# EAGLE schematic superbike-charger (EAGLE 9.6.1)
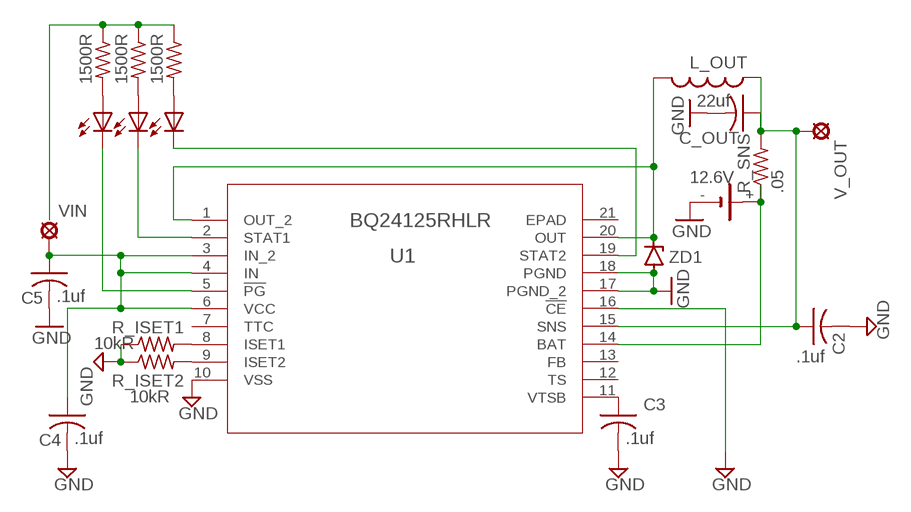
[diagram p0: schematic, sheet 1]

## Parts
12.6V  SL340P  [SL-340/P3.6V]
C2  .1uf  C-USC0805  [C0805]
C3  .1uf  C-USC0805  [C0805]
C4  .1uf  C-USC0805  [C0805]
C5  .1uf  C-USC0805  [C0805]
C_OUT  22uf  C-USC0805  [C0805]
L_OUT  L-USL3216C  [L3216C]
LED1  LED  [SMARTLED-TTW]
LED2  LED  [SMARTLED-TTW]
LED3  LED  [SMARTLED-TTW]
R_ISET1  10kR  R-US_R0805  [R0805]
R_ISET2  10kR  R-US_R0805  [R0805]
R_SNS  .05  R-US_R0402  [R0402]
RSYS1  1500R  R-US_R0805  [R0805]
RSYS2  1500R  R-US_R0805  [R0805]
RSYS3  1500R  R-US_R0805  [R0805]
U1  BQ24125RHLR  [RHL20_2P05X3P05]
V_OUT  LSP13  [LSP13]
VIN  LSP13  [LSP13]
ZD1  BZX55  [DO35Z10]

## Nets
GND: 12.6V.- C2.2 C3.2 C4.2 C5.2 C_OUT.2 R_ISET1.1 R_ISET2.1 U1.10(VSS) U1.16(!CE)
N$1: L_OUT.2 U1.1(OUT_2) U1.20(OUT) ZD1.C
N$2: U1.17(PGND_2) U1.18(PGND) ZD1.A ; supply symbol labelled GND
N$3: C2.1 C_OUT.1 L_OUT.1 R_SNS.2 U1.15(SNS) V_OUT.MP
N$5: R_ISET1.2 U1.8(ISET1)
N$6: R_ISET2.2 U1.9(ISET2)
N$7: 12.6V.+ R_SNS.1 U1.14(BAT)
N$8: C3.1 U1.11(VTSB)
N$9: C4.1 C5.1 U1.3(IN_2) U1.4(IN) U1.6(VCC) VIN.MP
N$10: LED1.C@1(C) U1.2(STAT1)
N$11: LED2.C@1(C) U1.19(STAT2)
N$12: LED3.C@1(C) U1.5(!PG)
N$13: RSYS1.1 RSYS2.1 RSYS3.1
N$14: LED3.A@1(A) RSYS1.2
N$15: LED1.A@1(A) RSYS2.2
N$16: LED2.A@1(A) RSYS3.2
Unconnected: U1.7(TTC) U1.12(TS) U1.13(FB) U1.21(EPAD)

## Library data of the parts
12.6V = battery:SL340P: LI BATTERY Sonnenschein SL-340 P 3.6 V
C2-C5 C_OUT = adafruit:C-US: CAPACITOR, American symbol
L_OUT = rcl:L-US: INDUCTOR, American symbol; SPICEPREFIX: L
LED1-LED3 = adafruit:LED: LED OSRAM: - CHIPLED LG R971, LG N971, LY N971, LG Q971, LY Q971, LO R971, LY R971 LH N974, LH R974 LS Q976, LO Q976, LY Q976 LO Q996 - Hyper CHIPLED LW Q18S LB Q993, LB Q99A, LB R99A - SideLED LS A670, LO A670, LY A670, LG A670, LP A670 LB A673, LV A673, LT A673, LW A673 LH A674 LY A675 LS A676, LA A676, LO A676, LY A676, LW A676 LS A679, LY A679, LG A679 - Hyper Micro SIDELED® LS Y876, LA Y876, LO Y876, LY Y876 LT Y87S - SmartLED LW L88C, LW L88S LB L89C, LB L89S, LG L890 LS L89K, LO L89K, LY L89K LS L896, LA L896, LO L896, LY L896 - TOPLED LS T670, LO T670, LY T670, LG T670, LP T670 LSG T670, LSP T670, LSY T670, LOP T670, LYG T670 LG T671, LOG T671, LSG T671 LB T673, LV T673, LT T673, LW T673 LH T674 LS T676, LA T676, LO T676, LY T676, LB T676, LH T676, LSB T676, LW T676 LB T67C, LV T67C, LT T67C, LS T67K, LO T67K, LY T67K, LW E67C LS E67B, LA E67B, LO E67B, LY E67B, LB E67C, LV E67C, LT E67C LW T67C LS T679, LY T679, LG T679 LS T770, LO T770, LY T770, LG T770, LP T770 LB T773, LV T773, LT T773, LW T773 LH T774 LS E675, LA E675, LY E675, LS T675 LS T776, LA T776, LO T776, LY T776, LB T776 LHGB T686 LT T68C, LB T68C - Hyper Mini TOPLED® LB M676 - Mini TOPLED Santana® LG M470 LS M47K, LO M47K, LY M47K Source: http://www.osram.convergy.de/
R_ISET1 R_ISET2 RSYS1-RSYS3 = adafruit:R-US_: RESISTOR, American symbol
R_SNS = rcl:R-US_: RESISTOR, American symbol; SPICEPREFIX: R
U1 = BQ24125:BQ24125RHLR; DATASHEET_URL: http://www.ti.com/lit/gpn/BQ24125; DESCRIPTION: Single Chip Switchmode Li-Ion and Li-Polymer Charge Management IC with Enhanced EMI Performance; FAMILY_NAME: BATTERY CHARGE MANAGEMENT; GENERIC_PART_NUMBER: BQ24125; INDUSTRY_STD_PKG_TYPE: QFN; MANUFACTURER: Texas Instruments; PACKAGE_DESIGNATOR: RHL; PIN_COUNT: 20
V_OUT VIN = solpad:LSP13: SOLDER PAD drill 1.3 mm, distributor Buerklin, 12H562
ZD1 = diode:BZX55: Z DIODE